# EAGLE design transistor (EAGLE 9.6.2)
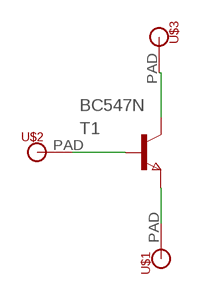
[diagram p0: schematic, sheet 1]

## Parts
T1  BC547N  [TO92]
U$1  MICROBIT_PAD  [MICROBIT_PAD]
U$2  MICROBIT_PAD  [MICROBIT_PAD]
U$3  MICROBIT_PAD  [MICROBIT_PAD]

## Nets
N$1: T1.1(C) U$3.PAD
N$2: T1.2(B) U$2.PAD
N$3: T1.3(E) U$1.PAD

## Library data of the parts
T1 = BC547:BC547: Check availability <https://pricing.snapeda.com/parts/BC547/ON%20Semiconductor/view-part?ref=eda>; AVAILABILITY: In Stock; CHECK_PRICES: https://www.snapeda.com/parts/BC547/Onsemi/view-part/?ref=eda; DESCRIPTION: Trans GP BJT NPN 45V 0.1A 500mW 3-Pin TO-92 T/R; MF: ON Semiconductor; MP: BC547; PACKAGE: None; PRICE: None; PURCHASE-URL: https://www.snapeda.com/api/url_track_click_mouser/?unipart_id=11254981&manufacturer=ON Semiconductor&part_name=BC547&search_term=None; SNAPEDA_LINK: https://www.snapeda.com/parts/BC547/Onsemi/view-part/?ref=snap
U$1-U$3 = microbit:MICROBIT_PAD

## Board
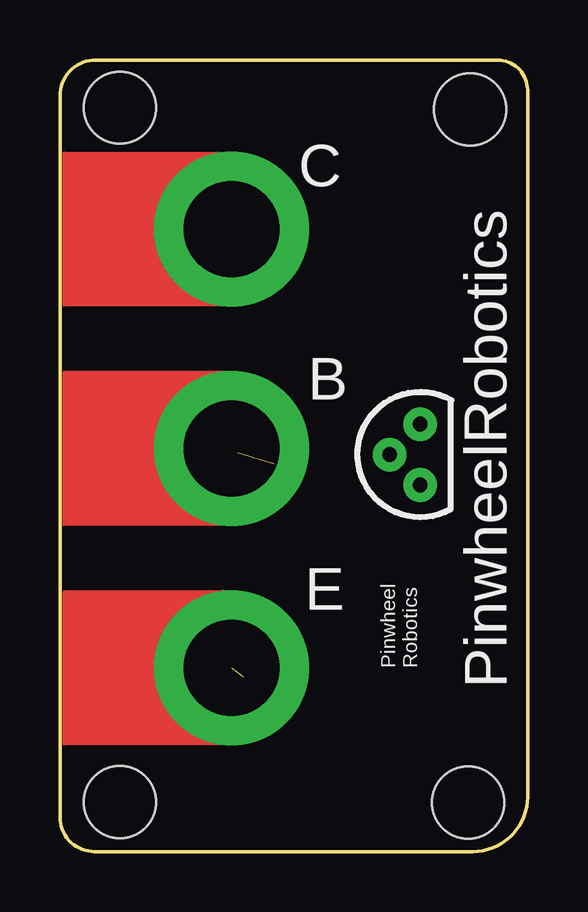
[diagram p1: board, top side]
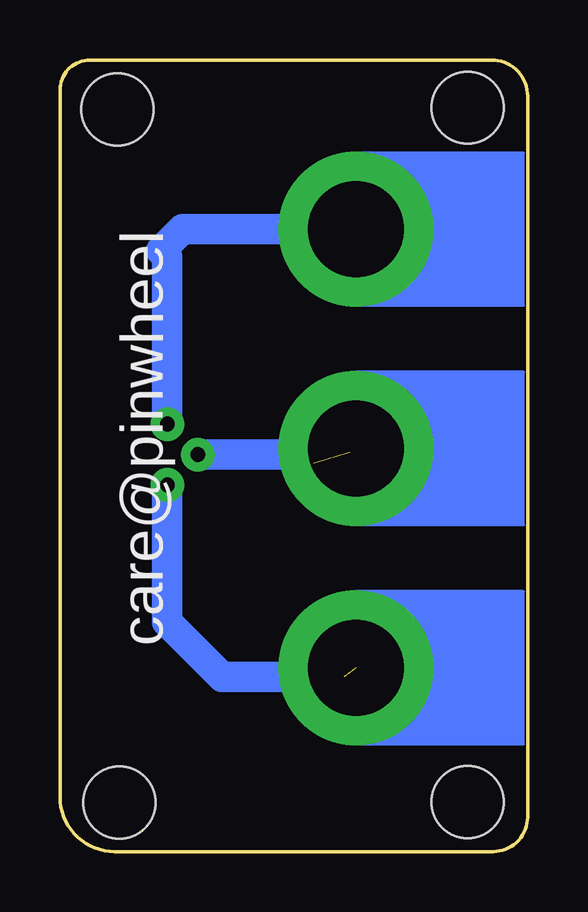
[diagram p2: board, bottom side, seen from below]

Size 19.5 x 33 mm. Coordinates in mm from the lower left corner, seen from the top.
Outline: 0,31.49 0,1.44 arc90 1.44,0 17.22,0 arc90 19.5,2.28 19.5,31.75 arc90 18.25,33 1.51,33 arc90 0,31.49
Copper layers (1*16): Top 0.035mm / dielectric 1.5mm / Bottom 0.035mm
Design rules "default": minimum track width 6mil, minimum drill 0.35mm, track to track 6mil, track to pad 6mil, pad to pad 6mil, via to via 6mil, smd to smd 6mil, copper to edge 40mil, drill to drill 6mil, minimum pad ring 10mil, minimum via ring 8mil, stop-mask expansion 4mil, vias tented up to drill 0mil, thermal gap 10mil
Holes 3 mm at 2.5,31.01 17.1,30.94 17.02,2.03 2.5,2.07

### Footprints (pad centres in the part's own frame; a part is rotated, then mirrored left to right if it is on the bottom)
TO92 = drill 0.61 pad 1.397: 1 0,0; 2 1.27,1.27; 3 2.54,0
MICROBIT_PAD = drill 4 pad 6.452: PAD 0,0

### Placement (x,y rotation side)
T1  15.03,15.28 90 top
U$1  7.15,25.95 270 top
U$2  7.15,16.8 270 top
U$3  7.15,7.66 270 top

### Tracks (layer width: path | path; a pad name or v marks a point on that pad's centre or on a via)
N$1  (1 unrouted)
  Bottom 0.152: 14.72,15.26 15.03,15.26 T1.1 | 7.25,7.79 U$3.PAD
  Bottom 1.27: T1.1 15.03,9.57 12.74,7.28 7.66,7.28
N$2  (1 unrouted)
  Bottom 0.152: 7.41,16.63 7.25,16.78 U$2.PAD | 13.65,16.63 T1.2
  Bottom 1.27: T1.2 9.31,16.55 8.93,16.17
N$3
  Bottom 0.152: 15.03,17.85 T1.3 | 6.95,25.92 U$1.PAD
  Bottom 1.27: T1.3 15.03,24.81 15.28,25.06 14.39,25.95 U$1.PAD

### Text on the board
tPlace: C | B | E | Pinwheel / Robotics | PinwheelRobotics
bPlace: care@pinwheel